# EAGLE schematic LCD_TO_ARDUINO (EAGLE 6.2)
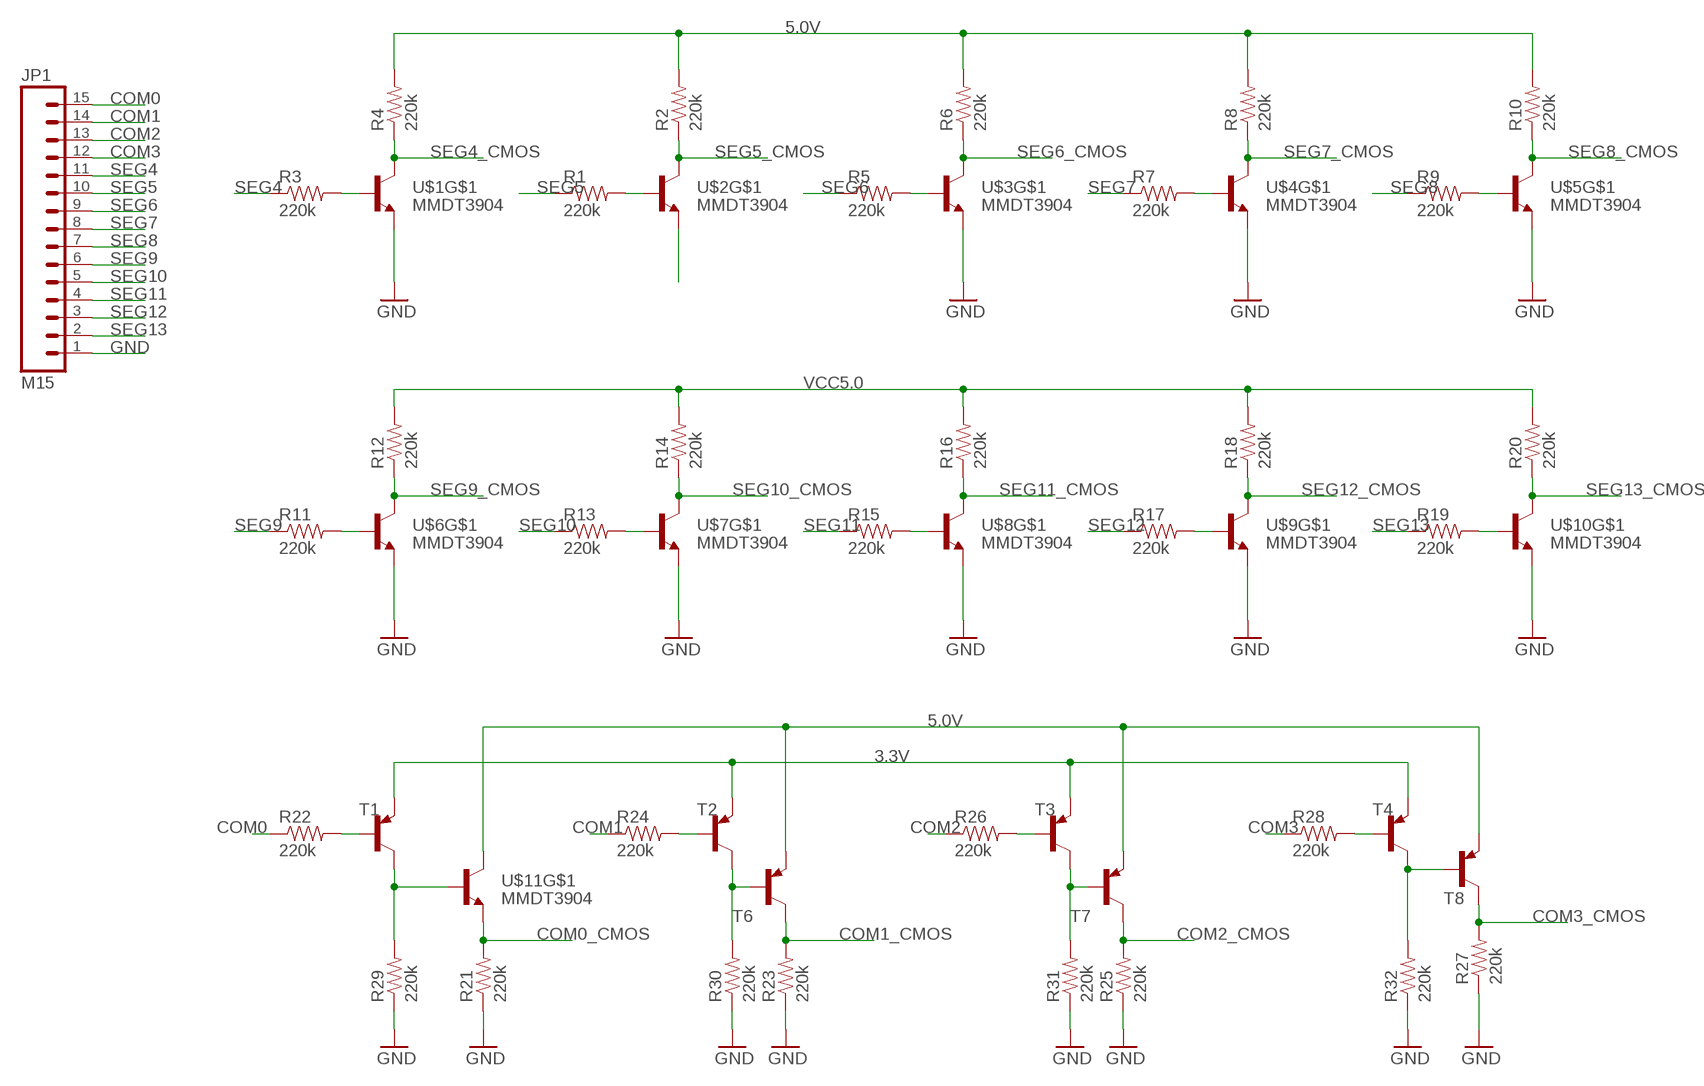
[diagram p0: schematic, sheet 1]

## Parts
JP1  M15  [1X15]
R1  220k  RESISTOR0805-RES  [0805]
R2  220k  RESISTOR0805-RES  [0805]
R3  220k  RESISTOR0805-RES  [0805]
R4  220k  RESISTOR0805-RES  [0805]
R5  220k  RESISTOR0805-RES  [0805]
R6  220k  RESISTOR0805-RES  [0805]
R7  220k  RESISTOR0805-RES  [0805]
R8  220k  RESISTOR0805-RES  [0805]
R9  220k  RESISTOR0805-RES  [0805]
R10  220k  RESISTOR0805-RES  [0805]
R11  220k  RESISTOR0805-RES  [0805]
R12  220k  RESISTOR0805-RES  [0805]
R13  220k  RESISTOR0805-RES  [0805]
R14  220k  RESISTOR0805-RES  [0805]
R15  220k  RESISTOR0805-RES  [0805]
R16  220k  RESISTOR0805-RES  [0805]
R17  220k  RESISTOR0805-RES  [0805]
R18  220k  RESISTOR0805-RES  [0805]
R19  220k  RESISTOR0805-RES  [0805]
R20  220k  RESISTOR0805-RES  [0805]
R21  220k  RESISTOR0805-RES  [0805]
R22  220k  RESISTOR0805-RES  [0805]
R23  220k  RESISTOR0805-RES  [0805]
R24  220k  RESISTOR0805-RES  [0805]
R25  220k  RESISTOR0805-RES  [0805]
R26  220k  RESISTOR0805-RES  [0805]
R27  220k  RESISTOR0805-RES  [0805]
R28  220k  RESISTOR0805-RES  [0805]
R29  220k  RESISTOR0805-RES  [0805]
R30  220k  RESISTOR0805-RES  [0805]
R31  220k  RESISTOR0805-RES  [0805]
R32  220k  RESISTOR0805-RES  [0805]
T1  MMBT3906LT1-PNP-SOT23-BEC  [SOT23-BEC]
T2  MMBT3906LT1-PNP-SOT23-BEC  [SOT23-BEC]
T3  MMBT3906LT1-PNP-SOT23-BEC  [SOT23-BEC]
T4  MMBT3906LT1-PNP-SOT23-BEC  [SOT23-BEC]
T6  MMBT3906LT1-PNP-SOT23-BEC  [SOT23-BEC]
T7  MMBT3906LT1-PNP-SOT23-BEC  [SOT23-BEC]
T8  MMBT3906LT1-PNP-SOT23-BEC  [SOT23-BEC]
U$1  MMDT3904  [SOT363]
U$2  MMDT3904  [SOT363]
U$3  MMDT3904  [SOT363]
U$4  MMDT3904  [SOT363]
U$5  MMDT3904  [SOT363]
U$6  MMDT3904  [SOT363]
U$7  MMDT3904  [SOT363]
U$8  MMDT3904  [SOT363]
U$9  MMDT3904  [SOT363]
U$10  MMDT3904  [SOT363]
U$11  MMDT3904  [SOT363]

## Nets
3.3V: T1.E T2.E T3.E T4.E
5.0V: R2.2 R4.2 R6.2 R8.2 R10.2 T6.E T7.E T8.E U$11.3(C)
COM0: JP1.15 R22.1
COM0_CMOS: R21.2 U$11.4(E)
COM1: JP1.14 R24.1
COM1_CMOS: R23.2 T6.C
COM2: JP1.13 R26.1
COM2_CMOS: R25.2 T7.C
COM3: JP1.12 R28.1
COM3_CMOS: R27.2 T8.C
GND: JP1.1 R21.1 R23.1 R25.1 R27.1 R29.1 R30.1 R31.1 R32.1 U$1.4(E) U$3.4(E) U$4.4(E) U$5.4(E) U$6.4(E) U$7.4(E) U$8.4(E) U$9.4(E) U$10.4(E)
N$1: U$2.4(E)
N$2: R3.2 U$1.5(B)
N$3: R1.2 U$2.5(B)
N$4: R29.2 T1.C U$11.5(B)
N$5: R5.2 U$3.5(B)
N$7: R7.2 U$4.5(B)
N$9: R9.2 U$5.5(B)
N$11: R11.2 U$6.5(B)
N$12: R30.2 T2.C T6.B
N$13: R13.2 U$7.5(B)
N$14: R31.2 T3.C T7.B
N$15: R15.2 U$8.5(B)
N$16: R32.2 T4.C T8.B
N$17: R17.2 U$9.5(B)
N$19: R19.2 U$10.5(B)
N$22: R22.2 T1.B
N$25: R24.2 T2.B
N$28: R26.2 T3.B
N$31: R28.2 T4.B
SEG4: JP1.11 R3.1
SEG4_CMOS: R4.1 U$1.3(C)
SEG5: JP1.10 R1.1
SEG5_CMOS: R2.1 U$2.3(C)
SEG6: JP1.9 R5.1
SEG6_CMOS: R6.1 U$3.3(C)
SEG7: JP1.8 R7.1
SEG7_CMOS: R8.1 U$4.3(C)
SEG8: JP1.7 R9.1
SEG8_CMOS: R10.1 U$5.3(C)
SEG9: JP1.6 R11.1
SEG9_CMOS: R12.1 U$6.3(C)
SEG10: JP1.5 R13.1
SEG10_CMOS: R14.1 U$7.3(C)
SEG11: JP1.4 R15.1
SEG11_CMOS: R16.1 U$8.3(C)
SEG12: JP1.3 R17.1
SEG12_CMOS: R18.1 U$9.3(C)
SEG13: JP1.2 R19.1
SEG13_CMOS: R20.1 U$10.3(C)
VCC5.0: R12.2 R14.2 R16.2 R18.2 R20.2
Unconnected: U$1.1(E) U$1.2(B) U$1.6(C) U$2.1(E) U$2.2(B) U$2.6(C) U$3.1(E) U$3.2(B) U$3.6(C) U$4.1(E) U$4.2(B) U$4.6(C) U$5.1(E) U$5.2(B) U$5.6(C) U$6.1(E) U$6.2(B) U$6.6(C) U$7.1(E) U$7.2(B) U$7.6(C) U$8.1(E) U$8.2(B) U$8.6(C) U$9.1(E) U$9.2(B) U$9.6(C) U$10.1(E) U$10.2(B) U$10.6(C) U$11.1(E) U$11.2(B) U$11.6(C)

## Library data of the parts
JP1 = SparkFun:M15: Header 15 Standard 15-pin 0.1" header. Use with straight break away headers (SKU : PRT-00116), right angle break away headers (PRT-00553), swiss pins (PRT-00743), machine pins (PRT-00117), and female headers (PRT-00115).
R1-R32 = SparkFun:RESISTOR: Resistor Basic schematic elements and footprints for 0603, 1206, and PTH resistors.
T1-T4 T6-T8 = transistor:*-PNP-: PNP Transistror
U$1-U$11 = SparkFun:MMDT3904